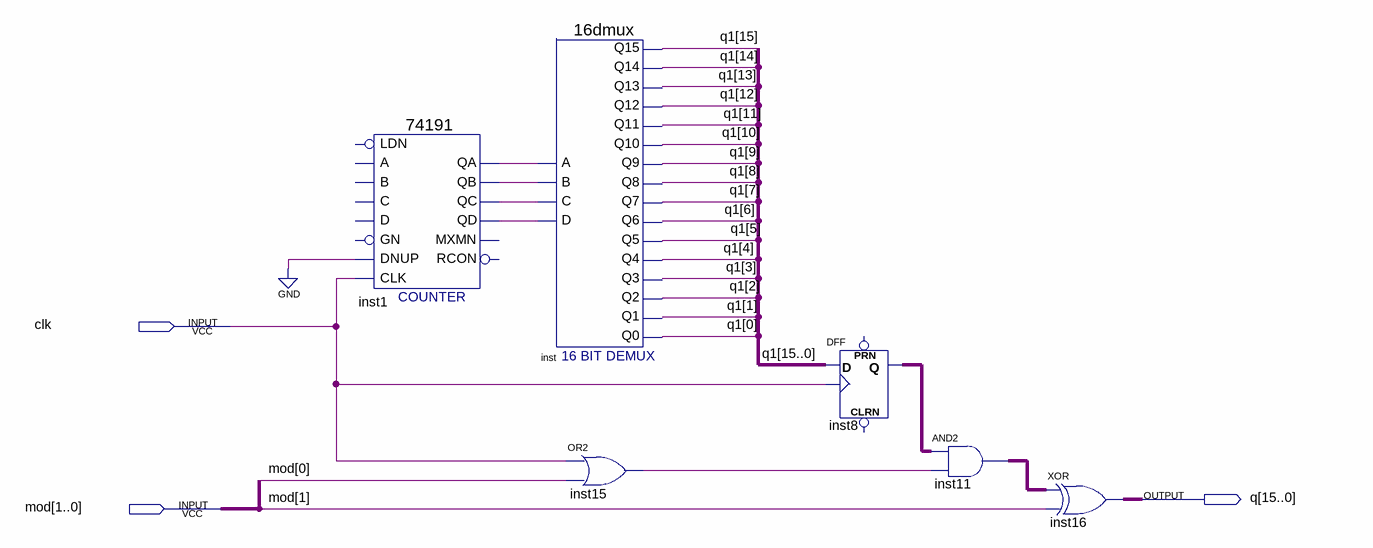
[diagram p0: schematic sheet]
// Quartus schematic Block3.bdf as structural Verilog: 6 symbols, 3 pins
module Block3 (
  input  clk,
  input  [1:0] mod,
  output [15:0] q
);

  wire inst1_qa, inst1_qb, inst1_qc, inst1_qd, inst15_out;
  wire [15:0] inst8_q, inst11_out, q1;

  \74191  inst1 (
    .CLK(clk), .DNUP(1'b0), .QA(inst1_qa), .QB(inst1_qb), .QD(inst1_qd), .QC(inst1_qc));  // open: LDN, D, C, B, A, GN, RCON, MXMN
  \16dmux  inst (
    .C(inst1_qc), .B(inst1_qb), .A(inst1_qa), .D(inst1_qd), .Q12(q1[12]), .Q13(q1[13]), .Q11(q1[11]),
    .Q9(q1[9]), .Q10(q1[10]), .Q7(q1[7]), .Q8(q1[8]), .Q4(q1[4]), .Q5(q1[5]), .Q6(q1[6]), .Q2(q1[2]),
    .Q3(q1[3]), .Q14(q1[14]), .Q15(q1[15]), .Q0(q1[0]), .Q1(q1[1]));
  or inst15 (inst15_out, clk, mod[0]);
  DFF inst8[15:0] (.CLK(clk), .D(q1), .Q(inst8_q));  // open: CLRN, PRN
  assign inst11_out = inst8_q & {16{inst15_out}};  // AND2 inst11, 16 bits wide
  assign q = inst11_out ^ {16{mod[1]}};  // XOR inst16, 16 bits wide
endmodule
